# Altium schematic sheet STM32C8 原理图.SchDoc
size A4
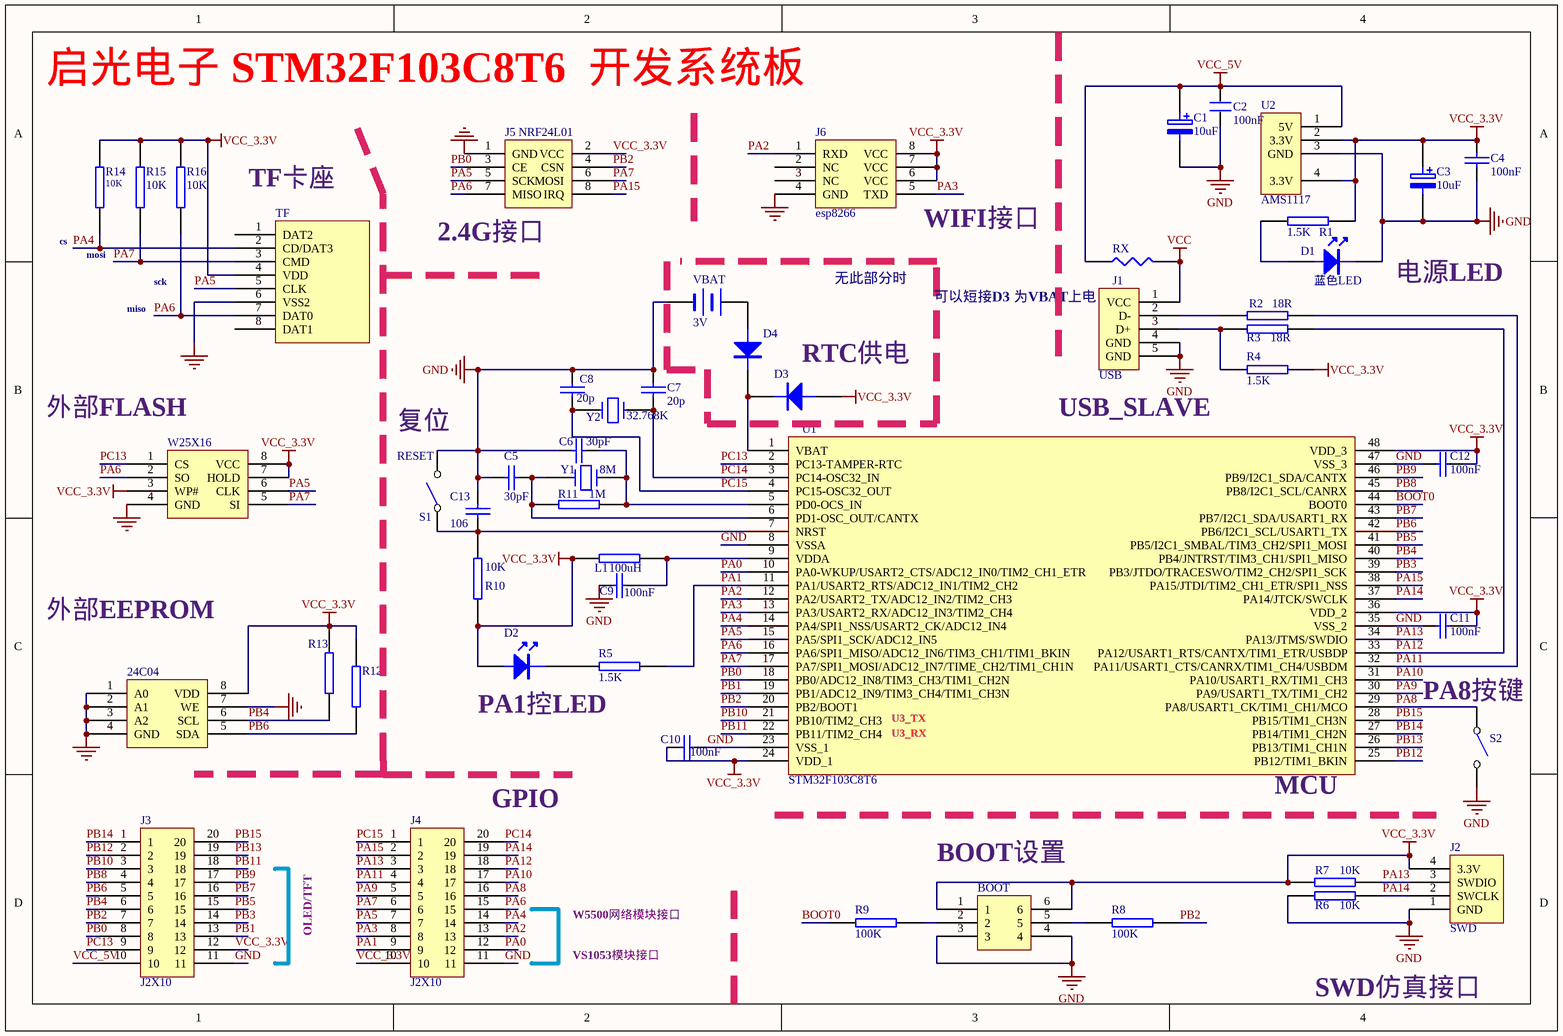
[diagram p0: STM32C8 原理图.SchDoc]

## Parts
24C04  (no value)  [STC15]
BOOT  (no value)  [PZ2*3]
C1  10uF  [3216z]
C2  100nF  [0603C1]
C3  10uF  [3216z]
C4  100nF  [0603C1]
C5  30pF  [0603C1]
C6  30pF  [0603C1]
C7  20p  [0603C1]
C8  20p  [0603C1]
C9  100nF  [0603C1]
C10  100nF  [0603C1]
C11  100nF  [0603C1]
C12  100nF  [0603C1]
C13  106  [0603C1]
D1  蓝色LED  [LED]
D2  (no value)  [LED]
D3  (no value)  [1206Z]
D4  (no value)  [1206Z]
J1  USB  [micro-dip]
J2  SWD  [90p4pz]
J3  J2X10  [PZ2X10]
J4  J2X10  [PZ2X10]
J5  NRF24L01  [NRF24L01]
J6  esp8266
L1  100uH  [0805z]
R1  1.5K  [0603R1]
R2  18R  [0603R1]
R3  18R  [0603R1]
R4  1.5K  [0603R1]
R5  1.5K  [0603R1]
R6  10K  [0603R1]
R7  10K  [0603R1]
R8  100K  [0603R1]
R9  100K  [0603R1]
R10  10K  [0603R1]
R11  1M  [0603R1]
R12  (no value)  [0603R1]
R13  (no value)  [0603R1]
R14  10K  [0805Z]
R15  10K  [0805Z]
R16  10K  [0805Z]
RX  (no value)  [1206z]
S1  (no value)  [FWAJ]
S2  (no value)  [FWAJ]
TF  (no value)  [TF]
U1  STM32F103C8T6  [STC12-48]
U2  AMS1117  [AMS1117]
VBAT  3V  [CR1220]
W25X16  (no value)  [W25X16]
Y1  8M  [YT]
Y2  32.768K  [32.768kt]

## Nets
GND: 24C04.1(A0) 24C04.2(A1) 24C04.3(A2) 24C04.4(GND) 24C04.7(WE) BOOT.3 BOOT.4 C1.2 C2.1 C3.2 C4.1 C5.2 C6.1 C7.2 C8.2 C9.2 C10.2 C11.1 C12.1 C13.1 D1.1 J1.4(GND) J1.5(GND) J2.1(GND) J3.11 J4.11 J5.1(GND) J6.4(GND) R6.1 S1.2 S2.2 TF.6(VSS2) U1.8(VSSA) U1.23(VSS_1) U1.35(VSS_2) U1.47(VSS_3) U2.3(GND) VBAT.2(-) W25X16.4(GND)
VCC: J1.1(VCC) RX.2
VCC_3.3V: 24C04.8(VDD) BOOT.1 BOOT.6 C3.1 C4.2 C10.1 C11.2 C12.2 D2.2 D3.1(A) J2.4(3.3V) J3.12 J4.10 J5.2(VCC) J6.6(VCC) J6.7(VCC) J6.8(VCC) L1.2 R1.2 R4.1 R7.1 R10.1 R12.2 R13.2 R14.1 R15.1 R16.1 TF.4(VDD) U1.24(VDD_1) U1.36(VDD_2) U1.48(VDD_3) U2.2(3.3V) U2.4(3.3V) W25X16.3(WP#) W25X16.7(HOLD) W25X16.8(VCC)
VCC_5V: C1.1 C2.2 J3.10 RX.1 U2.1(5V)
BOOT0: R9.2 U1.44(BOOT0)
PA0: J4.12 U1.10(PA0-WKUP/USART2_CTS/ADC12_IN0/TIM2_CH1_ETR)
PA1: J4.9 R5.1 U1.11(PA1/USART2_RTS/ADC12_IN1/TIM2_CH2)
PA2: J4.13 J6.1(RXD) U1.12(PA2/USART2_TX/ADC12_IN2/TIM2_CH3)
PA3: J4.8 J6.5(TXD) U1.13(PA3/USART2_RX/ADC12_IN3/TIM2_CH4)
PA4: J4.14 R14.2 TF.2(CD/DAT3) U1.14(PA4/SPI1_NSS/USART2_CK/ADC12_IN4)
PA5: J4.7 J5.5(SCK) TF.5(CLK) U1.15(PA5/SPI1_SCK/ADC12_IN5) W25X16.6(CLK)
PA6: J4.15 J5.7(MISO) R16.2 TF.7(DAT0) U1.16(PA6/SPI1_MISO/ADC12_IN6/TIM3_CH1/TIM1_BKIN) W25X16.2(SO)
PA7: J4.6 J5.6(MOSI) R15.2 TF.3(CMD) U1.17(PA7/SPI1_MOSI/ADC12_IN7/TIME_CH2/TIM1_CH1N) W25X16.5(SI)
PA8: J4.16 S2.1 U1.29(PA8/USART1_CK/TIM1_CH1/MCO)
PA9: J4.5 U1.30(PA9/USART1_TX/TIM1_CH2)
PA10: J4.17 U1.31(PA10/USART1_RX/TIM1_CH3)
PA11: J4.4 R2.2 U1.32(PA11/USART1_CTS/CANRX/TIM1_CH4/USBDM)
PA12: J4.18 R3.2 U1.33(PA12/USART1_RTS/CANTX/TIM1_ETR/USBDP)
PA13: J2.3(SWDIO) J4.3 R7.2 U1.34(PA13/JTMS/SWDIO)
PA14: J2.2(SWCLK) J4.19 R6.2 U1.37(PA14/JTCK/SWCLK)
PA15: J4.2 J5.8(IRQ) U1.38(PA15/JTDI/TIM2_CH1_ETR/SPI1_NSS)
PB0: J3.8 J5.3(CE) U1.18(PB0/ADC12_IN8/TIM3_CH3/TIM1_CH2N)
PB1: J3.13 U1.19(PB1/ADC12_IN9/TIM3_CH4/TIM1_CH3N)
PB2: J3.7 J5.4(CSN) R8.2 U1.20(PB2/BOOT1)
PB3: J3.14 U1.39(PB3/JTDO/TRACESWO/TIM2_CH2/SPI1_SCK)
PB4: 24C04.6(SCL) J3.6 R13.1 U1.40(PB4/JNTRST/TIM3_CH1/SPI1_MISO)
PB5: J3.15 U1.41(PB5/I2C1_SMBAL/TIM3_CH2/SPI1_MOSI)
PB6: 24C04.5(SDA) J3.5 R12.1 U1.42(PB6/I2C1_SCL/USART1_TX)
PB7: J3.16 U1.43(PB7/I2C1_SDA/USART1_RX)
PB8: J3.4 U1.45(PB8/I2C1_SCL/CANRX)
PB9: J3.17 U1.46(PB9/I2C1_SDA/CANTX)
PB10: J3.3 U1.21(PB10/TIM2_CH3)
PB11: J3.18 U1.22(PB11/TIM2_CH4)
PB12: J3.2 U1.25(PB12/TIM1_BKIN)
PB13: J3.19 U1.26(PB13/TIM1_CH1N)
PB14: J3.1 U1.27(PB14/TIM1_CH2N)
PB15: J3.20 U1.28(PB15/TIM1_CH3N)
PC13: J3.9 U1.2(PC13-TAMPER-RTC) W25X16.1(CS)
PC14: C7.1 J4.20 U1.3(PC14-OSC32_IN) Y2.1
PC15: C8.1 J4.1 U1.4(PC15-OSC32_OUT) Y2.2
NetBOOT_2: BOOT.2 R9.1
NetBOOT_5: BOOT.5 R8.1
NetC5_1: C5.1 R11.2 U1.6(PD1-OSC_OUT/CANTX) Y1.2
NetC6_2: C6.2 R11.1 U1.5(PD0-OCS_IN) Y1.1
NetC9_1: C9.1 L1.1 U1.9(VDDA)
NetC13_2: C13.2 R10.2 S1.1 U1.7(NRST)
NetD1_2: D1.2 R1.1
NetD2_1: D2.1 R5.2
NetD3_2: D3.2(K) D4.2(K) U1.1(VBAT)
NetD4_1: D4.1(A) VBAT.1(+)
NetJ1_2: J1.2(D-) R2.1
NetJ1_3: J1.3(D+) R3.1 R4.2

Not connected (* = marked no-connect by the designer): J6 2(NC) 3(NC); TF 1(DAT2) 8(DAT1)

## Notes on the sheet
- 启光电子 STM32F103C8T6  开发系统板
- (near R14) cs
- (near TF) TF卡座
- (near J5) 2.4G接口
- (near J6) WIFI接口
- mosi
- miso
- sck
- 无此部分时
- 可以短接D3 为VBAT上电
- 电源LED
- (near D3) RTC供电
- (near W25X16) 外部FLASH
- (near S1) 复位
- USB_SLAVE
- (near S1) RESET
- 外部EEPROM
- PA1控LED
- (near U1) U3_TX
- (near S2) PA8按键
- (near U1) U3_RX
- (near J4) GPIO
- (near U1) MCU
- W5500网络模块接口
- (near BOOT) BOOT设置
- OLED/TFT
- VS1053模块接口
- SWD仿真接口

## Library data of the parts
24C04 = 24C
BOOT = BOOT
C1 C3 = ELECTRO2: Electrolytic Capacitor
C2 = C
C4-C13 = CAP: Capacitor
D1 D2 = D
D3 D4 = DIODE
J2 = JSWD
L1 R1-R16 = RES2
RX = RES1
S1 S2 = SW-SPST
TF = MINISD
U1 = STM32C8T6
VBAT = BATTERY
W25X16 = W25X16
Y1 Y2 = CRYSTAL